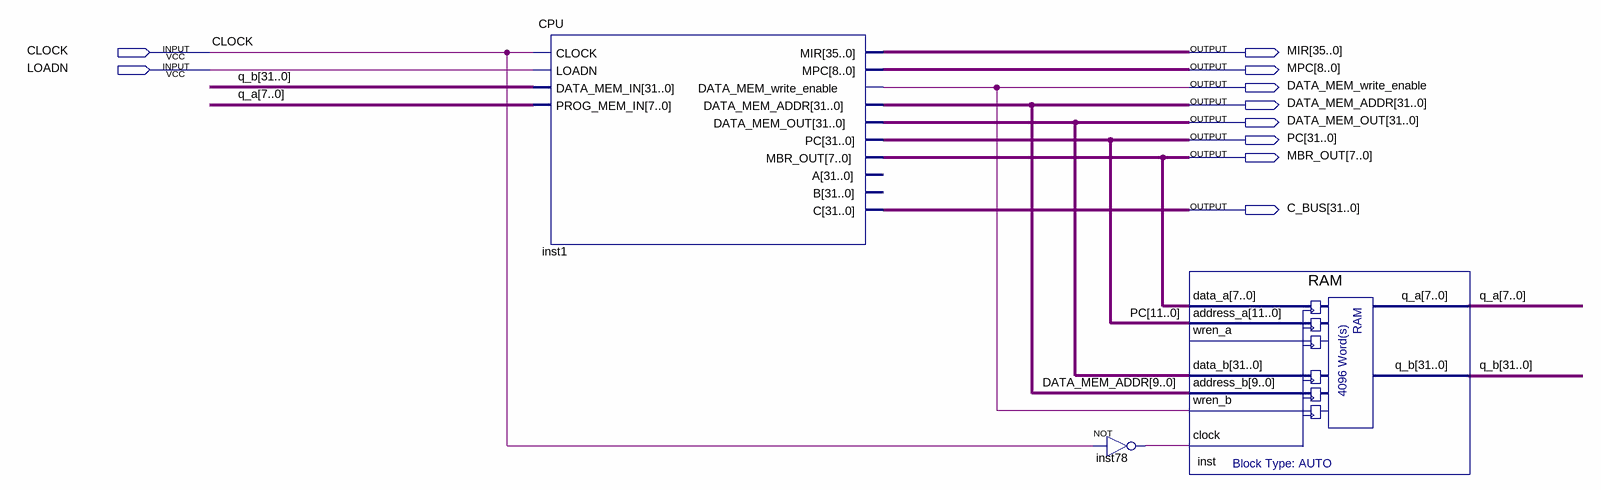
[diagram p0: schematic sheet]
// Quartus schematic Computador_MIC.bdf as structural Verilog: 3 symbols, 10 pins
module Computador_MIC (
  input  CLOCK,
  input  LOADN,
  output [35:0] MIR,
  output [8:0] MPC,
  output DATA_MEM_write_enable,
  output [31:0] DATA_MEM_ADDR,
  output [31:0] DATA_MEM_OUT,
  output [31:0] PC,
  output [7:0] MBR_OUT,
  output [31:0] C_BUS
);

  wire inst78_out;
  wire [7:0] q_a;
  wire [31:0] q_b;

  CPU inst1 (
    .CLOCK(CLOCK), .LOADN(LOADN), .DATA_MEM_IN(q_b), .PROG_MEM_IN(q_a), .MIR(MIR), .MPC(MPC),
    .DATA_MEM_write_enable(DATA_MEM_write_enable), .DATA_MEM_ADDR(DATA_MEM_ADDR),
    .DATA_MEM_OUT(DATA_MEM_OUT), .PC(PC), .MBR_OUT(MBR_OUT), .C(C_BUS));  // open: A, B
  not inst78 (inst78_out, CLOCK);
  RAM inst (
    .data_a(MBR_OUT), .address_a(PC[11:0]), .data_b(DATA_MEM_OUT), .address_b(DATA_MEM_ADDR[9:0]),
    .wren_b(DATA_MEM_write_enable), .clock(inst78_out), .q_a(q_a), .q_b(q_b));  // open: wren_a
endmodule
